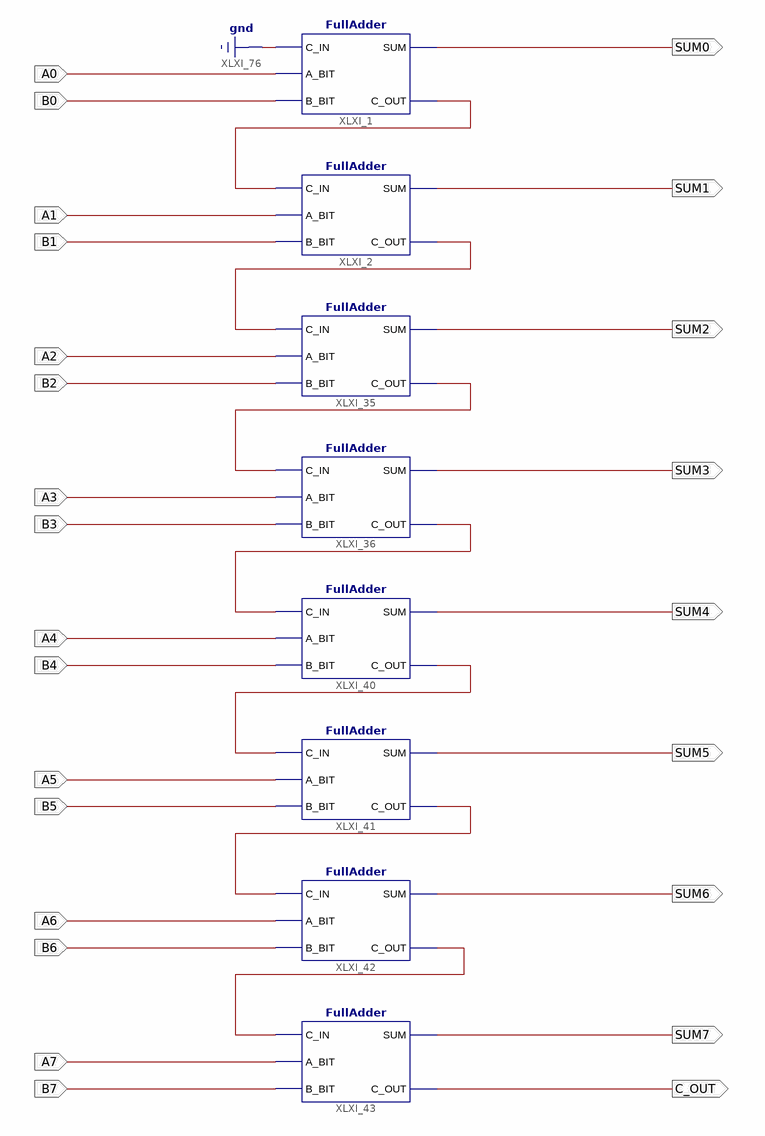
[diagram p0: schematic sheet 1]
// Xilinx ISE schematic Adder8Bits.sch (spartan6) as structural Verilog: 8 symbols, 25 ports
module Adder8Bits (
  input  A0,
  input  B0,
  input  A1,
  input  B1,
  input  A2,
  input  B2,
  input  A3,
  input  B3,
  input  A4,
  input  B4,
  input  A5,
  input  B5,
  input  A6,
  input  B6,
  input  A7,
  input  B7,
  output SUM0,
  output SUM1,
  output SUM2,
  output SUM3,
  output SUM4,
  output SUM5,
  output SUM6,
  output SUM7,
  output C_OUT
);

  wire XLXN_1, XLXN_2, XLXN_3, XLXN_4, XLXN_5, XLXN_6, XLXN_7;

  FullAdder XLXI_1 (.C_IN(1'b0), .A_BIT(A0), .B_BIT(B0), .SUM(SUM0), .C_OUT(XLXN_1));
  FullAdder XLXI_2 (.C_IN(XLXN_1), .A_BIT(A1), .B_BIT(B1), .SUM(SUM1), .C_OUT(XLXN_2));
  FullAdder XLXI_35 (.C_IN(XLXN_2), .A_BIT(A2), .B_BIT(B2), .SUM(SUM2), .C_OUT(XLXN_3));
  FullAdder XLXI_36 (.C_IN(XLXN_3), .A_BIT(A3), .B_BIT(B3), .SUM(SUM3), .C_OUT(XLXN_4));
  FullAdder XLXI_40 (.C_IN(XLXN_4), .A_BIT(A4), .B_BIT(B4), .SUM(SUM4), .C_OUT(XLXN_5));
  FullAdder XLXI_41 (.C_IN(XLXN_5), .A_BIT(A5), .B_BIT(B5), .SUM(SUM5), .C_OUT(XLXN_6));
  FullAdder XLXI_42 (.C_IN(XLXN_6), .A_BIT(A6), .B_BIT(B6), .SUM(SUM6), .C_OUT(XLXN_7));
  FullAdder XLXI_43 (.C_IN(XLXN_7), .A_BIT(A7), .B_BIT(B7), .SUM(SUM7), .C_OUT(C_OUT));
endmodule
